# Altium schematic sheet Encoder.SchDoc
size A; SheetNumber: 1; SheetTotal: 5
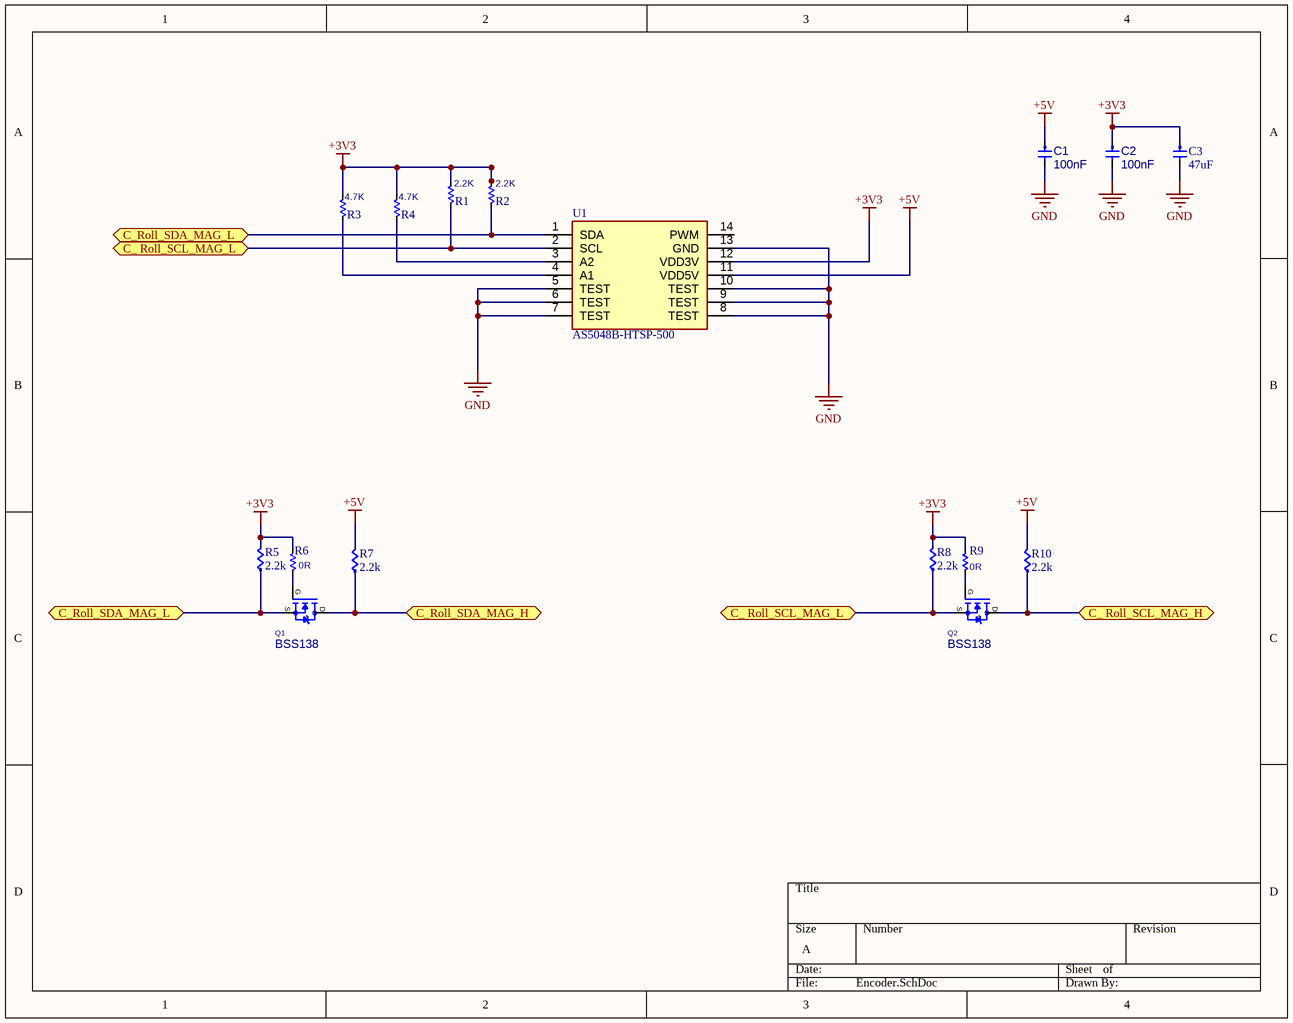
[diagram p0: Encoder.SchDoc]

## Parts
C1  Capacitance: 100nF  [CAP0603]  (hidden comment: C0603C104M5RACTU)
C2  Capacitance: 100nF  [CAP0603]  (hidden comment: C0603C104M5RACTU)
C3  Capacitance: 47uF  [CAP0805]  (hidden comment: CL21A476MQYNNNE)
Q1  BSS138  [BSS138]
Q2  BSS138  [BSS138]
R1  value 2.2K  [RES0603]  (hidden comment: RES0603)
R2  value 2.2K  [RES0603]  (hidden comment: RES0603)
R3  value 4.7K  [RES0603]  (hidden comment: RES0603)
R4  value 4.7K  [RES0603]  (hidden comment: RES0603)
R5  2.2k  [RES0603]
R6  value 0R  [RES0603]  (hidden comment: RES0603)
R7  2.2k  [RES0603]
R8  2.2k  [RES0603]
R9  value 0R  [RES0603]  (hidden comment: RES0603)
R10  2.2k  [RES0603]
U1  AS5048B-HTSP-500  [AS5048B-HTSP-500]

## Ports
C_ Roll_SCL_MAG_H (bidir), C_ Roll_SCL_MAG_L (bidir), C_Roll_SDA_MAG_H (bidir), C_Roll_SDA_MAG_L (bidir)

## Nets
+3V3: C2.1 C3.1 R1.1 R2.1 R3.1 R4.1 R5.2 R6.2 R8.2 R9.2 U1.12(VDD3V)
+5V: C1.1 R7.2 R10.2 U1.11(VDD5V)
GND: C1.2 C2.2 C3.2 U1.5(TEST) U1.6(TEST) U1.7(TEST) U1.8(TEST) U1.9(TEST) U1.10(TEST) U1.13(GND)
C_ Roll_SCL_MAG_H: Q2.3(D) R10.1 ; port C_ Roll_SCL_MAG_H
C_ Roll_SCL_MAG_L: Q2.2(S) R1.2 R8.1 U1.2(SCL) ; port C_ Roll_SCL_MAG_L
C_Roll_SDA_MAG_H: Q1.3(D) R7.1 ; port C_Roll_SDA_MAG_H
C_Roll_SDA_MAG_L: Q1.2(S) R2.2 R5.1 U1.1(SDA) ; port C_Roll_SDA_MAG_L
NetQ1_1: Q1.1(G) R6.1
NetQ2_1: Q2.1(G) R9.1
NetR3_2: R3.2 U1.4(A1)
NetR4_2: R4.2 U1.3(A2)

Not connected (* = marked no-connect by the designer): U1 14(PWM)

## Library data of the parts
C1 C2 = CMP-00691-1: CAP CER 0.1UF 50V X7R 0603; Manufacturer 1: KEMET; Tolerance: 20%; Dielectric Material: Ceramic; Dissipation Factor: 2.5%; Packaging: Tape and Reel; Mount: Surface Mount,PCB; Min Operating Temperature: -55°C; Case/Package: 0603; Max Operating Temperature: 125°C; Length: 1.6mm; Voltage Rating: 50V; Width: 0.031inch; Voltage Rating (DC): 50V; Dielectric: X7R; Thickness: 0.034inch; Case Code (Imperial): 0603; Case Code (Metric): 1608; Contact Plating: Tin,Matte; Depth: 0.8mm; Height: 0.8mm; Lead Pitch: 0.7mm; Manufacturer Part Number 1: C0603C104M5RACTU; Package Quantity: 1; Radiation Hardening: No; REACH SVHC: No SVHC; Termination: SMD/SMT
C3 = 885012107014: CAP CER 47UF 6.3V X5R 0805; Tolerance: 20%; Manufacturer Part Number: CL21A476MQYNNNE; RoHS: Yes; Category: Ceramic Capacitors; Stock 1: 3580; Pricing 1: 1=0.37000, 5=0.35200, 10=0.33000, 25=0.31900, 50=0.30900, 100=0.29800 (USD); Mount: Surface Mount; Case/Package: 0805; Case Code (Metric): 2012; Case Code (Imperial): 0805; Min Operating Temperature: -55°C; Max Operating Temperature: 85°C; Packaging: Cut Tape; Voltage Rating: 6.3V; Dielectric: X5R; Voltage Rating (DC): 6.3V; Series: WCAP-CSGP; Length: 0.079inch; Width: 0.049inch; Thickness: 0.057inch; RoHS Compliant: Yes; ComponentLink1URL: http://www.farnell.com/datasheets/1958454.pdf?src-supplier=Farnell; ComponentLink1Description: http://www.farnell.com/datasheets/1958454.pdf?src-supplier=Farnell; ComponentLink2URL: http://www.farnell.com/datasheets/1958454.pdf?src-supplier=Element14; ComponentLink2Description: http://www.farnell.com/datasheets/1958454.pdf?src-supplier=Element14; ComponentLink3URL: https://katalog.we-online.de/pbs/datasheet/885012107014.pdf?src-supplier=Digi-Key; ComponentLink3Description: https://katalog.we-online.de/pbs/datasheet/885012107014.pdf?src-supplier=Digi-Key; ComponentLink4URL: http://www.farnell.com/datasheets/1958454.pdf?src-supplier=Newark; ComponentLink4Description: http://www.farnell.com/datasheets/1958454.pdf?src-supplier=Newark; Supplier 1: Newark
Q1 Q2 = BSS138: N-Channel 50 V 220mA (Ta) 350mW (Ta) Surface Mount SOT-23-3; Drain to Source Voltage (Vdss): 50 V; (Max Rds On, Min Rds On: 4.5V, 10V; Rds On (Max) @ Id, Vgs: 3.5Ohm @ 220mA, 10V; Vgs(th) (Max) @ Id: 1.6V @ 1mA; Vgs (Max): ±20V; Input Capacitance (Ciss) (Max) @ Vds: 50 pF @ 25 V; Power Dissipation (Max): 225mW (Ta); MP: BSS138; FET Type: N-Channel; Current - Continuous Drain (Id) @ 25°C: 220mA; Operating Temperature: 150°C (TJ); Supplier Device Package: SOT-23
R1-R4 R6 R9 = RES0603: RES 0805; MP: add later
R5 R7 R8 R10 = RC0603FR-072K2L: Res Thick Film 0603 2.2K Ohm 1% 0.1W(1/10W) +/-100ppm/C Epoxy Pad SMD T/R; Manufacturer: Yageo Group; Max Power Dissipation: 100mW; Resistance: 2.2kΩ; Temperature Coefficient: 100ppm/°C; Voltage Rating: 75V; Voltage Rating (DC): 50V; Supplier 1: Avnet; Manufacturer Part Number: RC0603FR-072K2L; RoHS: Compliant; Category: Chip SMD Resistors; Stock 1: 415000; Pricing 1: 5000=0.00146, 10000=0.00141, 20000=0.00136, 30000=0.00131, 40000=0.00127 (USD); Case/Package: 0603; Case Code (Imperial): 0603; Case Code (Metric): 0603; China RoHS: Non-Compliant; Composition: Thick Film; Depth: 800µm; Features: Moisture Resistant; Height: 450µm; Lead Free: Lead Free; Length: 1.6mm; Lifecycle Status: Production; Max Operating Temperature: 155°C; Military Standard: Not; Min Operating Temperature: -55°C; Mount: Surface Mount; Number of Pins: 2; Number of Terminals: 2; Number of Terminations: 2; Packaging: Tape & Reel; Power Dissipation: 100mW; Power Rating: 100mW; REACH SVHC: Yes; Schedule B: 8533210045, 8533210045|8533210045|8533210045|8533210045|8533210045|8533210045|8533210045|8533210045|8533210045|8533210045|8533210045|8533210045|8533210045|8533210045|8533210045, 8533210045|8533210045|8533210045|8533210045|8533210045|8533210045|8533210045|8533210045|8533210045|8533210045|8533210045|8533210045|8533210045|8533210045|8533210045|8533210045, 8533210045|8533210045|8533210045|8533210045|8533210045|8533210045|8533210045|8533210045|8533210045|8533210045|8533210045|8533210045|8533210045|8533210045|8533210045|8533210045|8533210045; Termination: SMD/SMT; Tolerance: 1%; Width: 800µm; Working Voltage: 75V; ComponentLink1URL: https://datasheet.octopart.com:443/RC0603FR-072K2L-Yageo-datasheet-175887523.pdf?src-supplier=IHS; ComponentLink1Description: https://datasheet.octopart.com:443/RC0603FR-072K2L-Yageo-datasheet-175887523.pdf?src-supplier=IHS; ComponentLink2URL: https://datasheet.octopart.com:443/RC0603FR-072K2L-Yageo-datasheet-103092701.pdf?src-supplier=Upverter; ComponentLink2Description: https://datasheet.octopart.com:443/RC0603FR-072K2L-Yageo-datasheet-103092701.pdf?src-supplier=Upverter; ComponentLink3URL: https://datasheet.octopart.com:443/RC0603FR-072K2L-Yageo-datasheet-8328172.pdf?src-supplier=Newark; ComponentLink3Description: https://datasheet.octopart.com:443/RC0603FR-072K2L-Yageo-datasheet-8328172.pdf?src-supplier=Newark; ComponentLink4URL: https://datasheet.octopart.com:443/RC0603FR-072K2L-Yageo-datasheet-12596169.pdf?src-supplier=Newark; ComponentLink4Description: https://datasheet.octopart.com:443/RC0603FR-072K2L-Yageo-datasheet-12596169.pdf?src-supplier=Newark; ComponentLink5URL: https://datasheet.octopart.com:443/RC0603FR-072K2L-Yageo-datasheet-13691069.pdf?src-supplier=Newark; ComponentLink5Description: https://datasheet.octopart.com:443/RC0603FR-072K2L-Yageo-datasheet-13691069.pdf?src-supplier=Newark; ComponentLink6URL: https://datasheet.octopart.com:443/RC0603FR-072K2L-Yageo-datasheet-34211833.pdf?src-supplier=element14+APAC; ComponentLink6Description: https://datasheet.octopart.com:443/RC0603FR-072K2L-Yageo-datasheet-34211833.pdf?src-supplier=element14+APAC; ComponentLink7URL: https://datasheet.octopart.com:443/RC0603FR-072K2L-Yageo-datasheet-62067350.pdf?src-supplier=element14+APAC; ComponentLink7Description: https://datasheet.octopart.com:443/RC0603FR-072K2L-Yageo-datasheet-62067350.pdf?src-supplier=element14+APAC; ComponentLink8URL: https://datasheet.octopart.com:443/RC0603FR-072K2L-Yageo-datasheet-17842380.pdf?src-supplier=element14+APAC; ComponentLink8Description: https://datasheet.octopart.com:443/RC0603FR-072K2L-Yageo-datasheet-17842380.pdf?src-supplier=element14+APAC; ComponentLink9URL: https://datasheet.octopart.com:443/RC0603FR-072K2L-Yageo-datasheet-21426514.pdf?src-supplier=element14+APAC; ComponentLink9Description: https://datasheet.octopart.com:443/RC0603FR-072K2L-Yageo-datasheet-21426514.pdf?src-supplier=element14+APAC; ComponentLink10URL: https://datasheet.octopart.com:443/RC0603FR-072K2L-Yageo-datasheet-164759695.pdf?src-supplier=Future+Electronics; ComponentLink10Description: https://datasheet.octopart.com:443/RC0603FR-072K2L-Yageo-datasheet-164759695.pdf?src-supplier=Future+Electronics; ComponentLink11URL: https://datasheet.octopart.com:443/RC0603FR-072K2L-Yageo-datasheet-137700087.pdf?src-supplier=Future+Electronics; ComponentLink11Description: https://datasheet.octopart.com:443/RC0603FR-072K2L-Yageo-datasheet-137700087.pdf?src-supplier=Future+Electronics; ComponentLink12URL: https://datasheet.octopart.com:443/RC0603FR-072K2L-Yageo-datasheet-27584510.pdf?src-supplier=Future+Electronics; ComponentLink12Description: https://datasheet.octopart.com:443/RC0603FR-072K2L-Yageo-datasheet-27584510.pdf?src-supplier=Future+Electronics; ComponentLink13URL: https://datasheet.octopart.com:443/RC0603FR-072K2L-Yageo-datasheet-15599030.pdf?src-supplier=Future+Electronics; ComponentLink13Description: https://datasheet.octopart.com:443/RC0603FR-072K2L-Yageo-datasheet-15599030.pdf?src-supplier=Future+Electronics; ComponentLink14URL: https://datasheet.octopart.com:443/RC0603FR-072K2L-Yageo-datasheet-8324193.pdf?src-supplier=Future+Electronics; ComponentLink14Description: https://datasheet.octopart.com:443/RC0603FR-072K2L-Yageo-datasheet-8324193.pdf?src-supplier=Future+Electronics; ComponentLink15URL: https://datasheet.octopart.com:443/RC0603FR-072K2L-Yageo-datasheet-79472498.pdf?src-supplier=Megastar; ComponentLink15Description: https://datasheet.octopart.com:443/RC0603FR-072K2L-Yageo-datasheet-79472498.pdf?src-supplier=Megastar; ComponentLink16URL: https://datasheet.octopart.com/RC0603FR-072K2L-Yageo-datasheet-73766026.pdf; ComponentLink16Description: https://datasheet.octopart.com/RC0603FR-072K2L-Yageo-datasheet-73766026.pdf; ComponentLink17URL: https://datasheet.octopart.com:443/RC0603FR-072K2L-Yageo-datasheet-118562.pdf?src-supplier=DigiKey; ComponentLink17Description: https://datasheet.octopart.com:443/RC0603FR-072K2L-Yageo-datasheet-118562.pdf?src-supplier=DigiKey; ComponentLink18URL: https://datasheet.octopart.com:443/RC0603FR-072K2L-Yageo-datasheet-499455.pdf?src-supplier=element14; ComponentLink18Description: https://datasheet.octopart.com:443/RC0603FR-072K2L-Yageo-datasheet-499455.pdf?src-supplier=element14; ComponentLink19URL: http://sigma.octopart.com:80/rohs_statement/Yageo-company-2.pdf?src-supplier=Compliance+Statements; ComponentLink19Description: http://sigma.octopart.com:80/rohs_statement/Yageo-company-2.pdf?src-supplier=Compliance+Statements; ComponentLink20URL: http://sigma.octopart.com:80/conflict_mineral_statement/Yageo-company-3.pdf?src-supplier=Compliance+Statements; ComponentLink20Description: http://sigma.octopart.com:80/conflict_mineral_statement/Yageo-company-3.pdf?src-supplier=Compliance+Statements; Supplier Part Number 1: RC0603FR-072K2L
U1 = AS5048B-HTSP-500: Hall Effect Sensor Angle External Magnet, Not Included Gull Wing; Rotation Angle - Electrical, Mechanical: 0° ~ 360°, Continuous; Output: I2C, PWM; Voltage - Supply: 3V ~ 3.6V, 4.5V ~ 5.5V; MP: AS5048B-HTSP-500; Technology: Hall Effect; Actuator Type: External Magnet, Not Included; Mounting TypeOperating Temperature: -40°C ~ 150°C; Package / Case: 14-TSSOP